# EAGLE design LDR-1 (EAGLE 7.2.0)
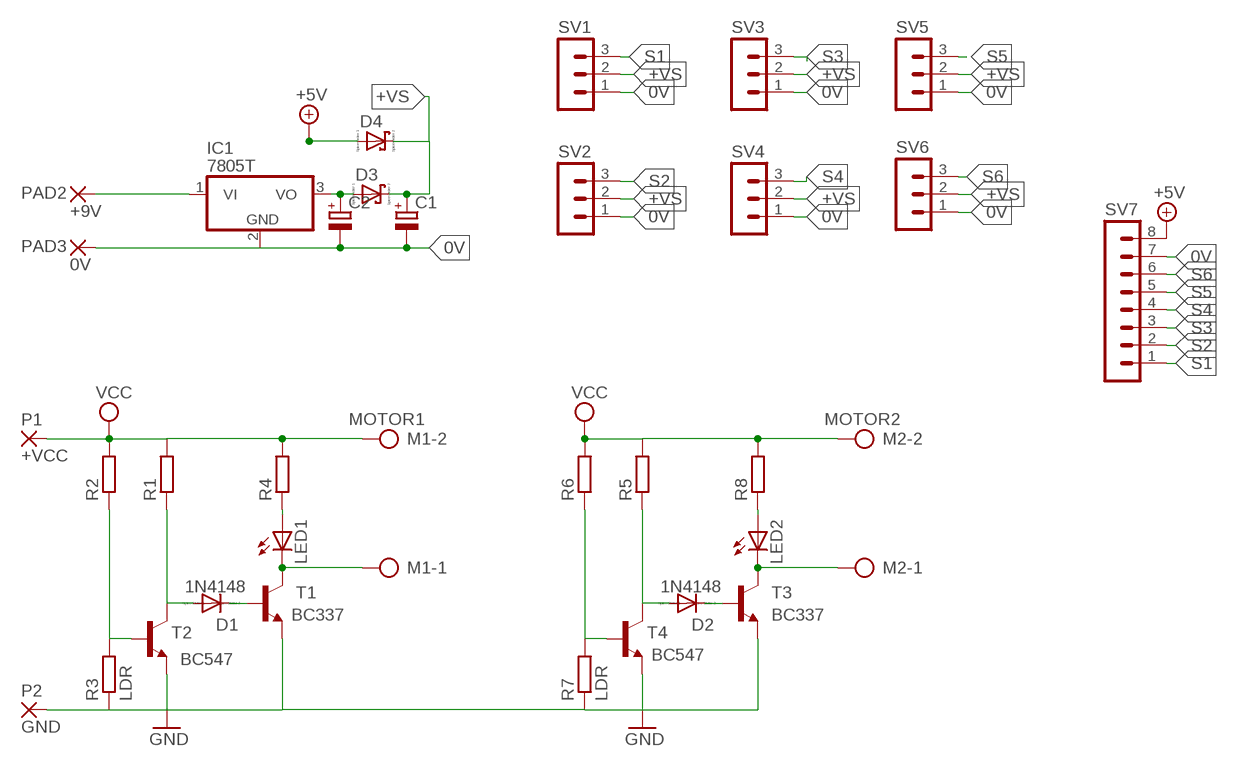
[diagram p0: schematic, sheet 1]

## Parts
C1  CPOL-EUE2.5-5  [E2,5-5]
C2  CPOL-EUE2.5-5  [E2,5-5]
D1  1N4148  1N4148DO35-7  [DO35-7]
D2  1N4148  1N4148DO35-7  [DO35-7]
D3  SCHOTTKY-DIODEDO35-7  [DIODE_DO35-7]
D4  SCHOTTKY-DIODEDO35-7  [DIODE_DO35-7]
IC1  7805T  [TO220H]
LED1  LED3MM  [LED3MM]
LED2  LED3MM  [LED3MM]
M1  MOTOR1  AK500/2  [AK500/2]
M2  MOTOR2  AK500/2  [AK500/2]
P1  +VCC  WIREPAD2,15/1,0  [2,15/1,0]
P2  GND  WIREPAD2,15/1,0  [2,15/1,0]
PAD2  +9V  WIREPAD2,15/1,0  [2,15/1,0]
PAD3  0V  WIREPAD2,15/1,0  [2,15/1,0]
R1  R-EU_0207/7  [0207/7]
R2  R-EU_0207/7  [0207/7]
R3  LDR  R-EU_0204/5  [0204/5]
R4  R-EU_0207/7  [0207/7]
R5  R-EU_0207/7  [0207/7]
R6  R-EU_0207/7  [0207/7]
R7  LDR  R-EU_0204/5  [0204/5]
R8  R-EU_0207/7  [0207/7]
SV1  MA03-1  [MA03-1]
SV2  MA03-1  [MA03-1]
SV3  MA03-1  [MA03-1]
SV4  MA03-1  [MA03-1]
SV5  MA03-1  [MA03-1]
SV6  MA03-1  [MA03-1]
SV7  MA08-1  [MA08-1]
T1  BC337  BC337-25-NPN-TO92-CBE  [TO92-CBE]
T2  BC547  BC547-NPN-TO92-CBE  [TO92-CBE]
T3  BC337  BC337-25-NPN-TO92-CBE  [TO92-CBE]
T4  BC547  BC547-NPN-TO92-CBE  [TO92-CBE]

## Nets
0V: C1.- C2.- IC1.2(GND) PAD3.1(P) SV1.1 SV2.1 SV3.1 SV4.1 SV5.1 SV6.1 SV7.7
+5V: D4.A(C) SV7.8
+VS: C1.+ D3.C(A) D4.C(A) SV1.2 SV2.2 SV3.2 SV4.2 SV5.2 SV6.2
GND: P2.1(P) R3.1 R7.1 T1.E T2.E T3.E T4.E
N$1: D1.C T1.B
N$2: D1.A R1.1 T2.C
N$3: LED1.K(C) M1.1 T1.C
N$4: C2.+ D3.A(C) IC1.3(VO)
N$5: LED1.A R4.1
N$6: R2.1 R3.2 T2.B
N$7: D2.C T3.B
N$8: D2.A R5.1 T4.C
N$9: LED2.K(C) M2.1 T3.C
N$11: R6.1 R7.2 T4.B
N$12: LED2.A R8.1
N$13: IC1.1(VI) PAD2.1(P)
S1: SV1.3 SV7.1
S2: SV2.3 SV7.2
S3: SV3.3 SV7.3
S4: SV4.3 SV7.4
S5: SV5.3 SV7.5
S6: SV6.3 SV7.6
VCC: M1.2 M2.2 P1.1(P) R1.2 R2.2 R4.2 R5.2 R6.2 R8.2

## Library data of the parts
C1 C2 = rcl:CPOL-EU: POLARIZED CAPACITOR, European symbol
D1 D2 = diode:1N4148: DIODE high speed (Philips)
D3 D4 = eagle-ltspice:SCHOTTKY-DIODE: Schottky Diode; SPICEMODEL: NONE; SPICEPREFIX: D; SPICETYPE: diode
IC1 = linear:78*: Positive VOLTAGE REGULATOR Source: http://cache.national.com/ds/LM/LM78L05.pdf http://www.fairchildsemi.com/ds/LM/LM7805.pdf
LED1 LED2 = led:LED: LED OSRAM: - CHIPLED LG R971, LG N971, LY N971, LG Q971, LY Q971, LO R971, LY R971 LH N974, LH R974 LS Q976, LO Q976, LY Q976 LO Q996 - Hyper CHIPLED LW Q18S LB Q993, LB Q99A, LB R99A - SideLED LS A670, LO A670, LY A670, LG A670, LP A670 LB A673, LV A673, LT A673, LW A673 LH A674 LY A675 LS A676, LA A676, LO A676, LY A676, LW A676 LS A679, LY A679, LG A679 - Hyper Micro SIDELED® LS Y876, LA Y876, LO Y876, LY Y876 LT Y87S - SmartLED LW L88C, LW L88S LB L89C, LB L89S, LG L890 LS L89K, LO L89K, LY L89K LS L896, LA L896, LO L896, LY L896 - TOPLED LS T670, LO T670, LY T670, LG T670, LP T670 LSG T670, LSP T670, LSY T670, LOP T670, LYG T670 LG T671, LOG T671, LSG T671 LB T673, LV T673, LT T673, LW T673 LH T674 LS T676, LA T676, LO T676, LY T676, LB T676, LH T676, LSB T676, LW T676 LB T67C, LV T67C, LT T67C, LS T67K, LO T67K, LY T67K, LW E67C LS E67B, LA E67B, LO E67B, LY E67B, LB E67C, LV E67C, LT E67C LW T67C LS T679, LY T679, LG T679 LS T770, LO T770, LY T770, LG T770, LP T770 LB T773, LV T773, LT T773, LW T773 LH T774 LS E675, LA E675, LY E675, LS T675 LS T776, LA T776, LO T776, LY T776, LB T776 LHGB T686 LT T68C, LB T68C - Hyper Mini TOPLED® LB M676 - Mini TOPLED Santana® LG M470 LS M47K, LO M47K, LY M47K Source: http://www.osram.convergy.de LUXEON: - LUMILED® LXK2-PW12-R00, LXK2-PW12-S00, LXK2-PW14-U00, LXK2-PW14-V00 LXK2-PM12-R00, LXK2-PM12-S00, LXK2-PM14-U00 LXK2-PE12-Q00, LXK2-PE12-R00, LXK2-PE12-S00, LXK2-PE14-T00, LXK2-PE14-U00 LXK2-PB12-K00, LXK2-PB12-L00, LXK2-PB12-M00, LXK2-PB14-N00, LXK2-PB14-P00, LXK2-PB14-Q00 LXK2-PR12-L00, LXK2-PR12-M00, LXK2-PR14-Q00, LXK2-PR14-R00 LXK2-PD12-Q00, LXK2-PD12-R00, LXK2-PD12-S00 LXK2-PH12-R00, LXK2-PH12-S00 LXK2-PL12-P00, LXK2-PL12-Q00, LXK2-PL12-R00 Source: www.luxeon.com KINGBRIGHT: KA-3528ASYC Source: www.kingbright.com
M1 M2 = con-ptr500:AK500/2: CONNECTOR; OC_FARNELL: unknown; OC_NEWARK: unknown
P1 P2 PAD2 PAD3 = wirepad:WIREPAD: Wire PAD connect wire on PCB
R1-R8 = resistor:R-EU_: RESISTOR, European symbol
SV1-SV6 = con-lstb:MA03-1: PIN HEADER; OC_FARNELL: unknown; OC_NEWARK: unknown
SV7 = con-lstb:MA08-1: PIN HEADER; OC_FARNELL: unknown; OC_NEWARK: unknown
T1-T4 = transistor:*-NPN-: NPN Transistror BF959 corrected 2008.03.06

## Board
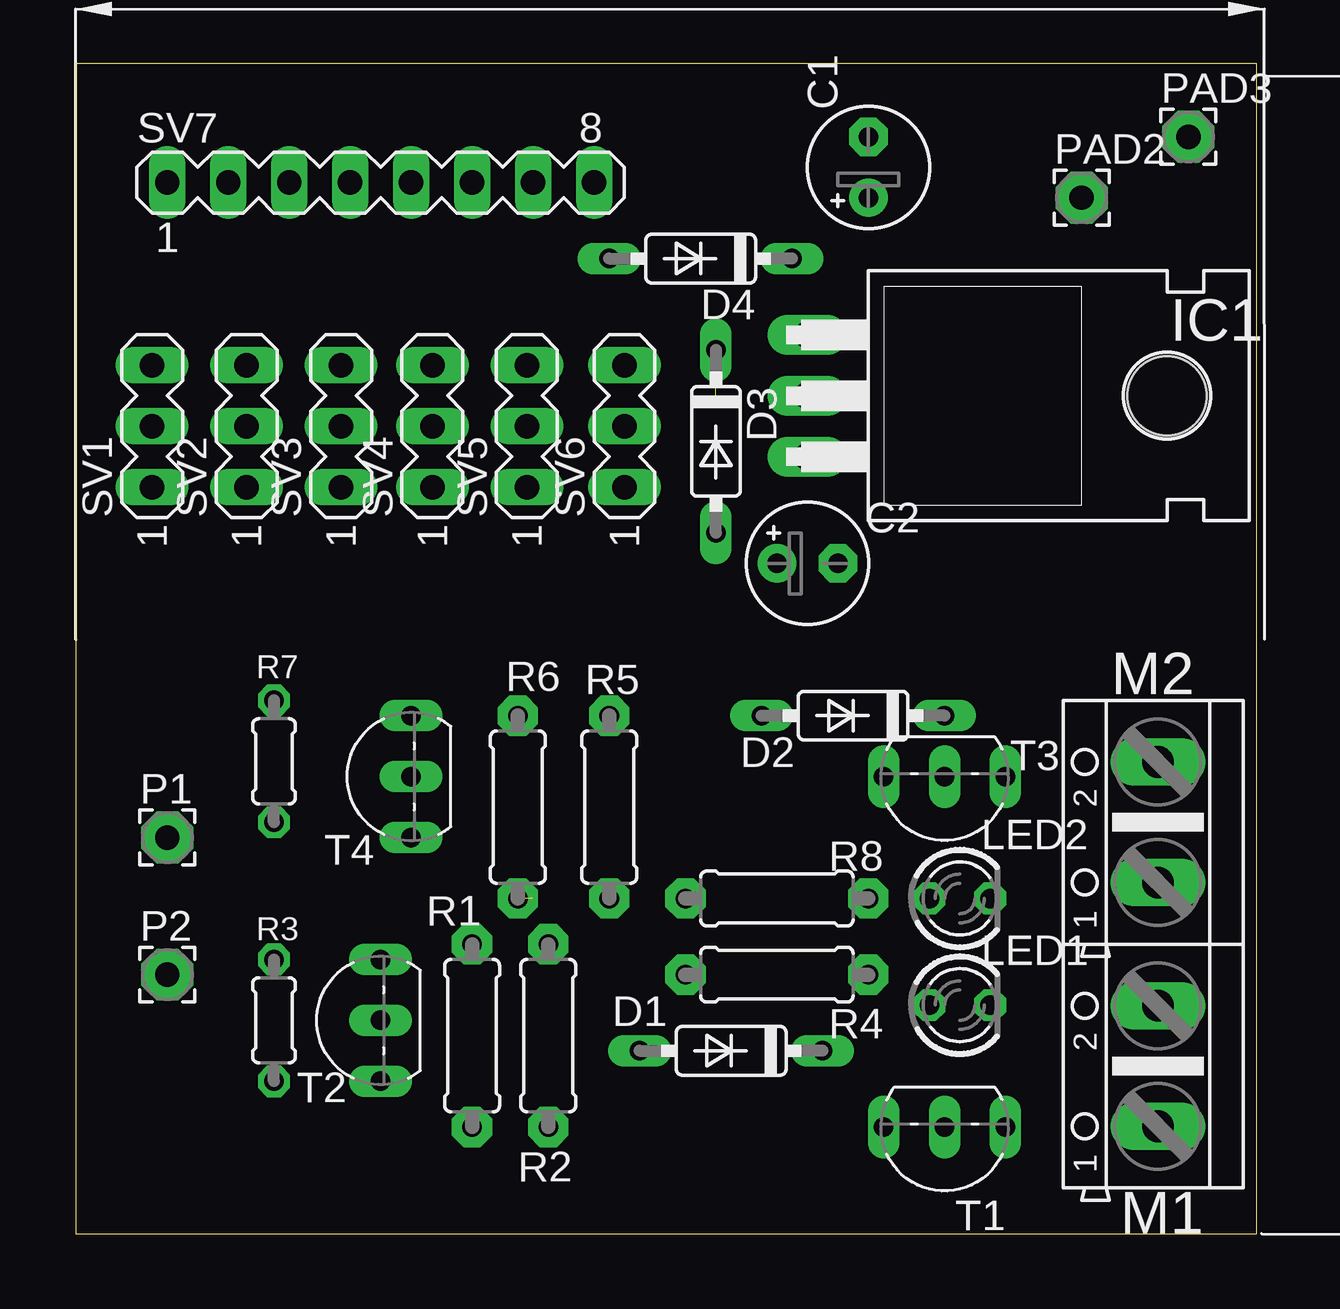
[diagram p1: board, top side]
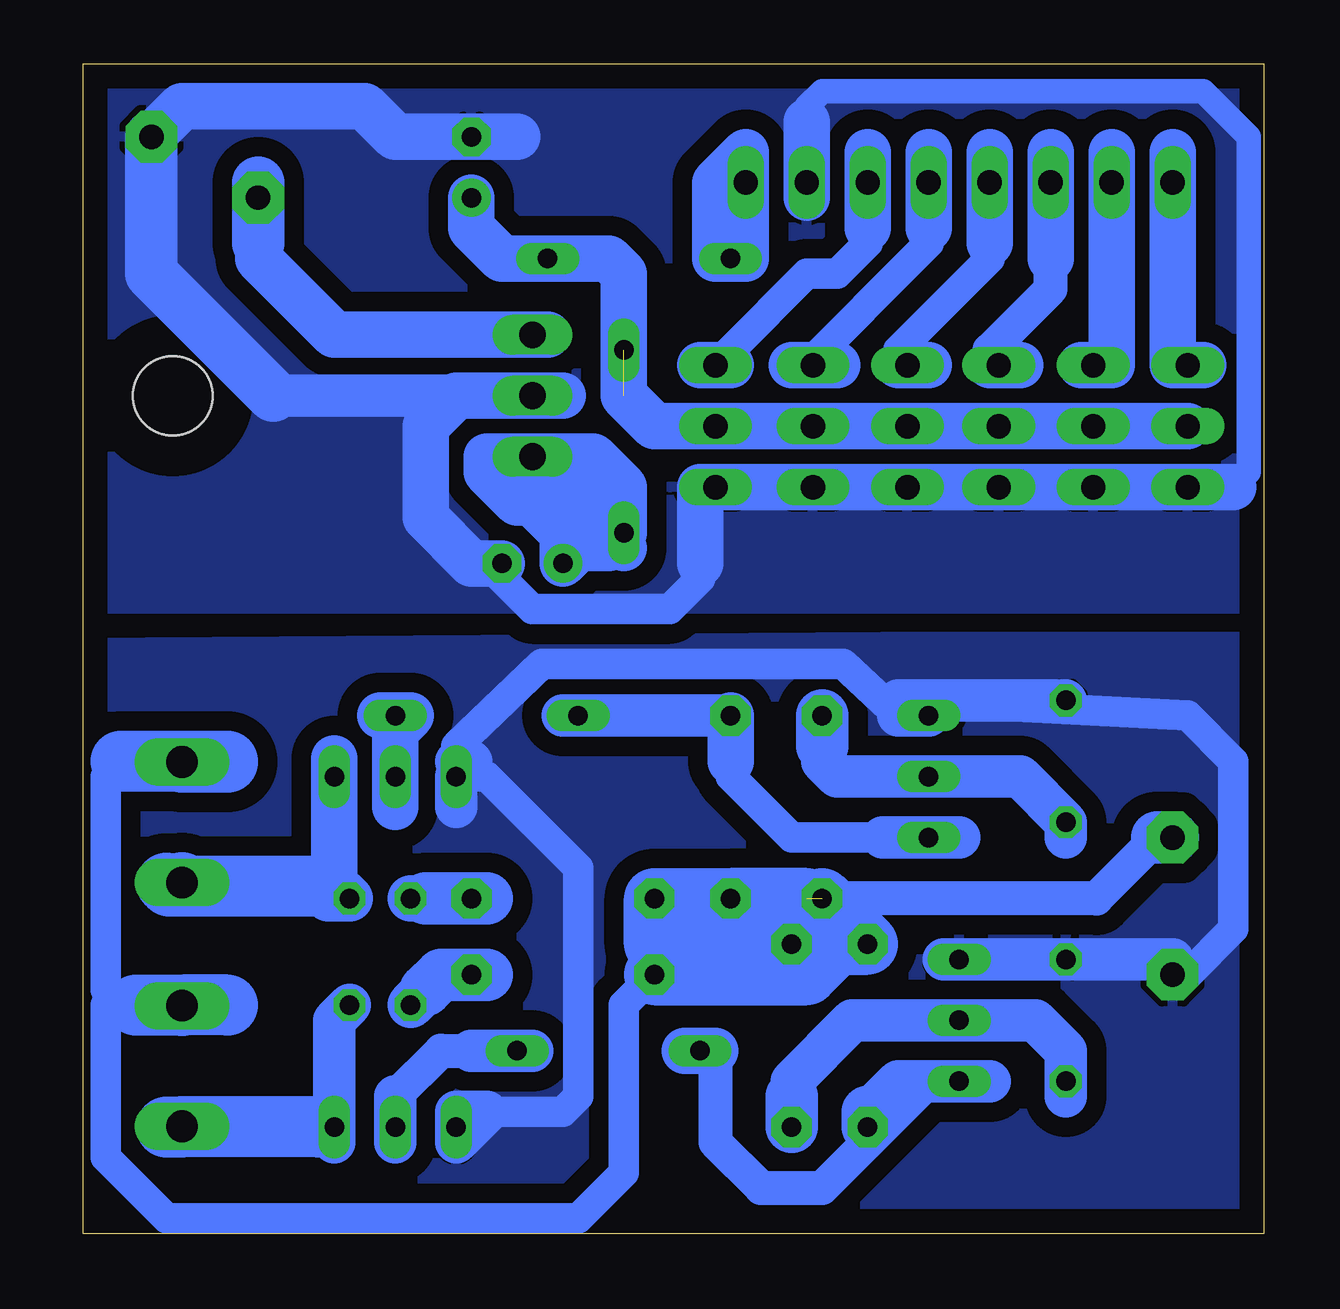
[diagram p2: board, bottom side, seen from below]

Size 49.2 x 48.76 mm. Coordinates in mm from the lower left corner, seen from the top.
Outline: 0,0 49.2,0 49.2,48.76 0,48.76 0,0
Copper layers (1*16): Top 0.035mm / dielectric 1.5mm / Bottom 0.035mm
Design rules "default": minimum track width 10mil, minimum drill 24mil, track to track 8mil, track to pad 8mil, pad to pad 8mil, via to via 8mil, smd to smd 8mil, copper to edge 40mil, drill to drill 8mil, minimum pad ring 10mil, minimum via ring 8mil, stop-mask expansion 4mil, vias tented up to drill 0mil, thermal gap 10mil

### Footprints (pad centres in the part's own frame; a part is rotated, then mirrored left to right if it is on the bottom)
E2,5-5 = drill 0.813 pad 1.6: + -1.27,0 | drill 0.813 pad 1.6 octagon: - 1.27,0
DO35-7 = drill 0.813 long: A 3.81,0; C -3.81,0
DIODE_DO35-7 = drill 0.813 long: A 3.81,0; C -3.81,0
TO220H = drill 1.118 long: 1 -2.54,-10.16; 2 0,-10.16; 3 2.54,-10.16 | hole 3.302: 0,4.826
LED3MM = drill 0.813 octagon: A -1.27,0; K 1.27,0
AK500/2 = drill 1.321 long: 1 -2.515,0; 2 2.515,0
2,15/1,0 = drill 1.016 pad 2.159 octagon: 1 0,0
0207/7 = drill 0.813 pad 1.676 octagon: 1 -3.81,0; 2 3.81,0
0204/5 = drill 0.813 octagon: 1 -2.54,0; 2 2.54,0
MA03-1 = drill 1.016 long: 1 -2.54,0; 2 0,0; 3 2.54,0
MA08-1 = drill 1.016 long: 1 -8.89,0; 2 -6.35,0; 3 -3.81,0; 4 -1.27,0; 5 1.27,0; 6 3.81,0; 7 6.35,0; 8 8.89,0
TO92-CBE = drill 0.813 long: B 0,0; C -2.54,0; E 2.54,0

### Placement (x,y rotation side)
C1  33.02,44.45 90 top
C2  30.48,27.94 0 top
D1  27.3,7.62 180 top
D2  32.39,21.59 180 top
D3  26.67,33.02 270 top
D4  26.04,40.64 180 top
IC1  40.64,34.92 270 top
LED1  36.83,9.52 0 top
LED2  36.83,13.97 0 top
M1  45.09,6.98 90 top
M2  45.09,17.14 90 top
P1  3.81,16.51 0 top
P2  3.81,10.79 0 top
PAD2  41.91,43.18 0 top
PAD3  46.36,45.72 0 top
R1  16.51,8.25 90 top
R2  19.68,8.25 90 top
R3  8.26,8.89 270 top
R4  29.21,10.79 180 top
R5  22.22,17.78 270 top
R6  18.41,17.78 270 top
R7  8.26,19.68 270 top
R8  29.21,13.97 180 top
SV1  3.17,33.66 90 top
SV2  7.11,33.66 90 top
SV3  11.05,33.66 90 top
SV4  14.86,33.66 90 top
SV5  18.8,33.66 90 top
SV6  22.86,33.66 90 top
SV7  12.7,43.81 0 top
T1  36.2,4.45 180 top
T2  12.7,8.89 90 top
T3  36.2,19.05 180 top
T4  13.97,19.05 90 top

### Tracks (layer width: path | path; a pad name or v marks a point on that pad's centre or on a via)
0V
  Bottom 1.016: 1.27,31.11 0.64,31.75 0.64,45.72 2.54,47.62 18.41,47.62 19.05,46.99 19.05,46.36
  Bottom 1.27: 23.49,27.94 23.49,27.3 24.76,26.04 30.48,26.04 32.39,27.94
  Bottom 1.778: 41.27,34.92 31.11,34.92
  Bottom 1.93: 19.05,46.36 SV7.7 19.05,43.18 | C2.- 32.39,27.94 33.02,27.94 34.93,29.85 34.93,33.66 33.66,34.92 31.11,34.92 IC1.2 29.21,34.92 | 1.27,31.11 SV1.1 SV2.1 SV3.1 SV4.1 SV5.1 SV6.1 23.49,31.11 23.49,27.94 | 31.11,45.72 C1.- 36.2,45.72 37.47,46.99 45.09,46.99 PAD3.1
  Bottom 2.184: PAD3.1 46.36,40 41.27,34.92
  pour Bottom (isolate 0.813): 0,26.04 49.53,26.04 49.53,48.89 0,48.89
+5V
  Bottom 1.93: SV7.8 21.59,45.08 22.86,43.81 22.86,40.64 D4.A | SV7.8 21.59,40.64 D4.A | SV7.8 D4.A
+VS  (1 unrouted)
  Bottom 1.93: C1.+ 33.02,41.91 31.75,40.64 D4.C 27.3,40.64 26.67,40 26.67,34.92 25.4,33.66 SV6.2 SV5.2 SV4.2 SV3.2 SV2.2 SV1.2
GND
  Bottom 1.27: T3.E 32.39,19.05 28.57,15.24 28.57,5.71 29.21,5.08 32.39,5.08 | 33.66,19.68 33.66,20.32 30.1,23.75 17.53,23.75 15.24,21.59 | 15.24,22.22 3.17,21.59 1.27,19.68 1.27,12.7 3.17,10.79 P2.1
  Bottom 1.778: 13.34,11.43 T2.E R3.1 3.81,11.43 P2.1 | R7.1 15.24,22.22 T4.E 15.24,21.59 | 33.02,5.08 33.66,5.08 T1.E | T1.E 33.66,3.81 32.39,5.08 33.02,5.08 | 33.02,5.08 T1.E | 33.66,17.78 T3.E 33.02,19.68 33.66,19.68
  pour Bottom (isolate 0.813): 0,0 49.4,0 49.4,24.64 15.88,24.89 0,24.89
N$1
  Bottom 1.422: 36.2,5.71 34.29,7.62 33.02,7.62
  Bottom 1.778: 36.2,3.81 T1.B 36.2,5.71 | 33.02,7.62 D1.C 30.48,7.62
N$2
  Bottom 1.422: 22.86,7.62 22.86,3.81 20.95,1.91 18.41,1.91 13.97,6.35
  Bottom 1.778: 11.43,6.35 T2.C 13.97,6.35 15.24,6.35 16.51,5.08
  Bottom 1.93: 24.13,7.62 D1.A 22.86,7.62
  Bottom 2.184: 16.51,5.08 R1.1
N$3
  Bottom 1.778: LED1.K 38.73,8.89 T1.C | 38.73,3.81 T1.C | T1.C 39.37,4.45
  Bottom 2.54: 39.37,4.45 45.11,4.45 | 45.72,4.45 45.11,4.45 | 45.11,4.45 M1.1
N$4
  Bottom 1.93: D3.A 26.67,31.11 27.94,32.39 IC1.3 | IC1.3 32.39,32.39 32.39,31.75 31.11,30.48 30.48,30.48 | 30.48,30.48 29.84,30.48 29.21,29.85 27.94,29.85 | 27.94,29.85 26.67,28.57 | 27.94,29.85 29.21,31.11 29.21,30.48 27.3,28.57 28.57,28.57 C2.+ 29.21,29.21 30.48,30.48 | 30.48,30.48 IC1.3
N$5
  Bottom 1.93: 34.93,10.16 LED1.A
  Bottom 2.184: 32.39,10.79 R4.1 34.29,10.79 34.93,10.16
N$6
  Bottom 1.778: 19.68,5.71 19.68,6.35 17.14,8.89 T2.B 9.53,8.89 8.26,7.62 R3.2 8.26,5.71
  Bottom 2.184: 19.68,5.71 R2.1
N$7
  Bottom 1.93: 36.2,17.78 T3.B 36.2,20.96 35.56,21.59 D2.C 36.83,21.59
N$8
  Bottom 1.27: 15.88,16.51 19.68,16.51 22.22,19.05 22.22,19.68
  Bottom 1.778: 12.7,16.51 T4.C 15.88,16.51 | 29.21,21.59 D2.A R5.1
  Bottom 1.93: 22.22,19.68 R5.1
N$9
  Bottom 1.778: 38.73,19.68 T3.C
  Bottom 1.93: 38.73,19.81 T3.C 38.73,14.61 LED2.K 38.99,13.97 39.5,14.48 39.62,14.48
  Bottom 2.54: 39.62,14.48 45.59,14.48 45.72,14.61 45.11,14.61 M2.1
N$11
  Bottom 1.778: 8.26,16.51 R7.2 10.16,19.05 T4.B 17.78,19.05 18.41,19.68 18.41,20.32
  Bottom 2.184: R6.1 18.41,20.32
N$12
  Bottom 1.93: 34.93,13.97 LED2.A
  Bottom 2.184: 32.39,13.97 R8.1 34.93,13.97
N$13
  Bottom 1.93: 29.84,37.47 IC1.1 38.73,37.47 41.91,40.64 41.91,41.28
  Bottom 2.184: 41.91,41.28 PAD2.1 41.91,43.81
S1
  Bottom 1.93: 2.54,36.19 SV1.3 3.81,36.19 SV7.1 3.81,45.08
S2
  Bottom 1.93: 7.62,36.19 SV2.3 6.35,36.19 SV7.2 6.35,45.08
S3
  Bottom 1.422: 11.43,36.19 11.43,36.83 8.89,39.37 8.89,40.64
  Bottom 1.93: 11.43,36.19 SV3.3 10.16,36.19 | 8.89,40.64 SV7.3 8.89,45.08
S4
  Bottom 1.27: 13.97,36.19 15.24,36.19 15.24,36.83 11.43,40.64 11.43,41.28
  Bottom 1.93: 15.24,36.19 SV4.3 13.97,36.19 | 11.43,41.28 SV7.4 11.43,45.08
S5
  Bottom 1.27: 17.78,36.19 18.41,36.83 14.92,40.32 13.97,41.28 13.97,41.91
  Bottom 1.93: 13.97,45.08 SV7.5 13.97,41.91 | 17.78,36.19 SV5.3 19.68,36.19
S6
  Bottom 1.27: 22.22,36.19 22.22,36.83 19.05,40 17.78,40 16.51,41.28 16.51,41.91
  Bottom 1.93: 23.49,36.19 SV6.3 22.22,36.19 | 16.51,41.91 SV7.6 16.51,45.08
VCC  (1 unrouted)
  Bottom 1.27: 47.62,19.68 48.26,19.05 48.26,10.16 47.62,9.52 46.99,9.52 | M1.2 48.23,9.5 48.26,9.52 48.26,3.18 45.72,0.63 28.57,0.63 26.67,2.54 26.67,9.52 R4.2 24.13,12.07
  Bottom 1.422: 4.45,16.51 6.99,13.97 19.05,13.97
  Bottom 2.184: P1.1 4.45,16.51
  Bottom 2.54: M2.2 43.18,19.66 43.18,19.68 47.62,19.68 | 46.99,9.52 45.06,9.52 | 43.18,9.52 45.06,9.52 | 45.06,9.52 M1.2 | R4.2 19.05,10.79 17.78,12.07 R1.2 R6.2 | R2.2 25.4,12.07 R8.2 R5.2 19.05,13.97